# EAGLE schematic Carrier v1.0 (EAGLE 6.2)
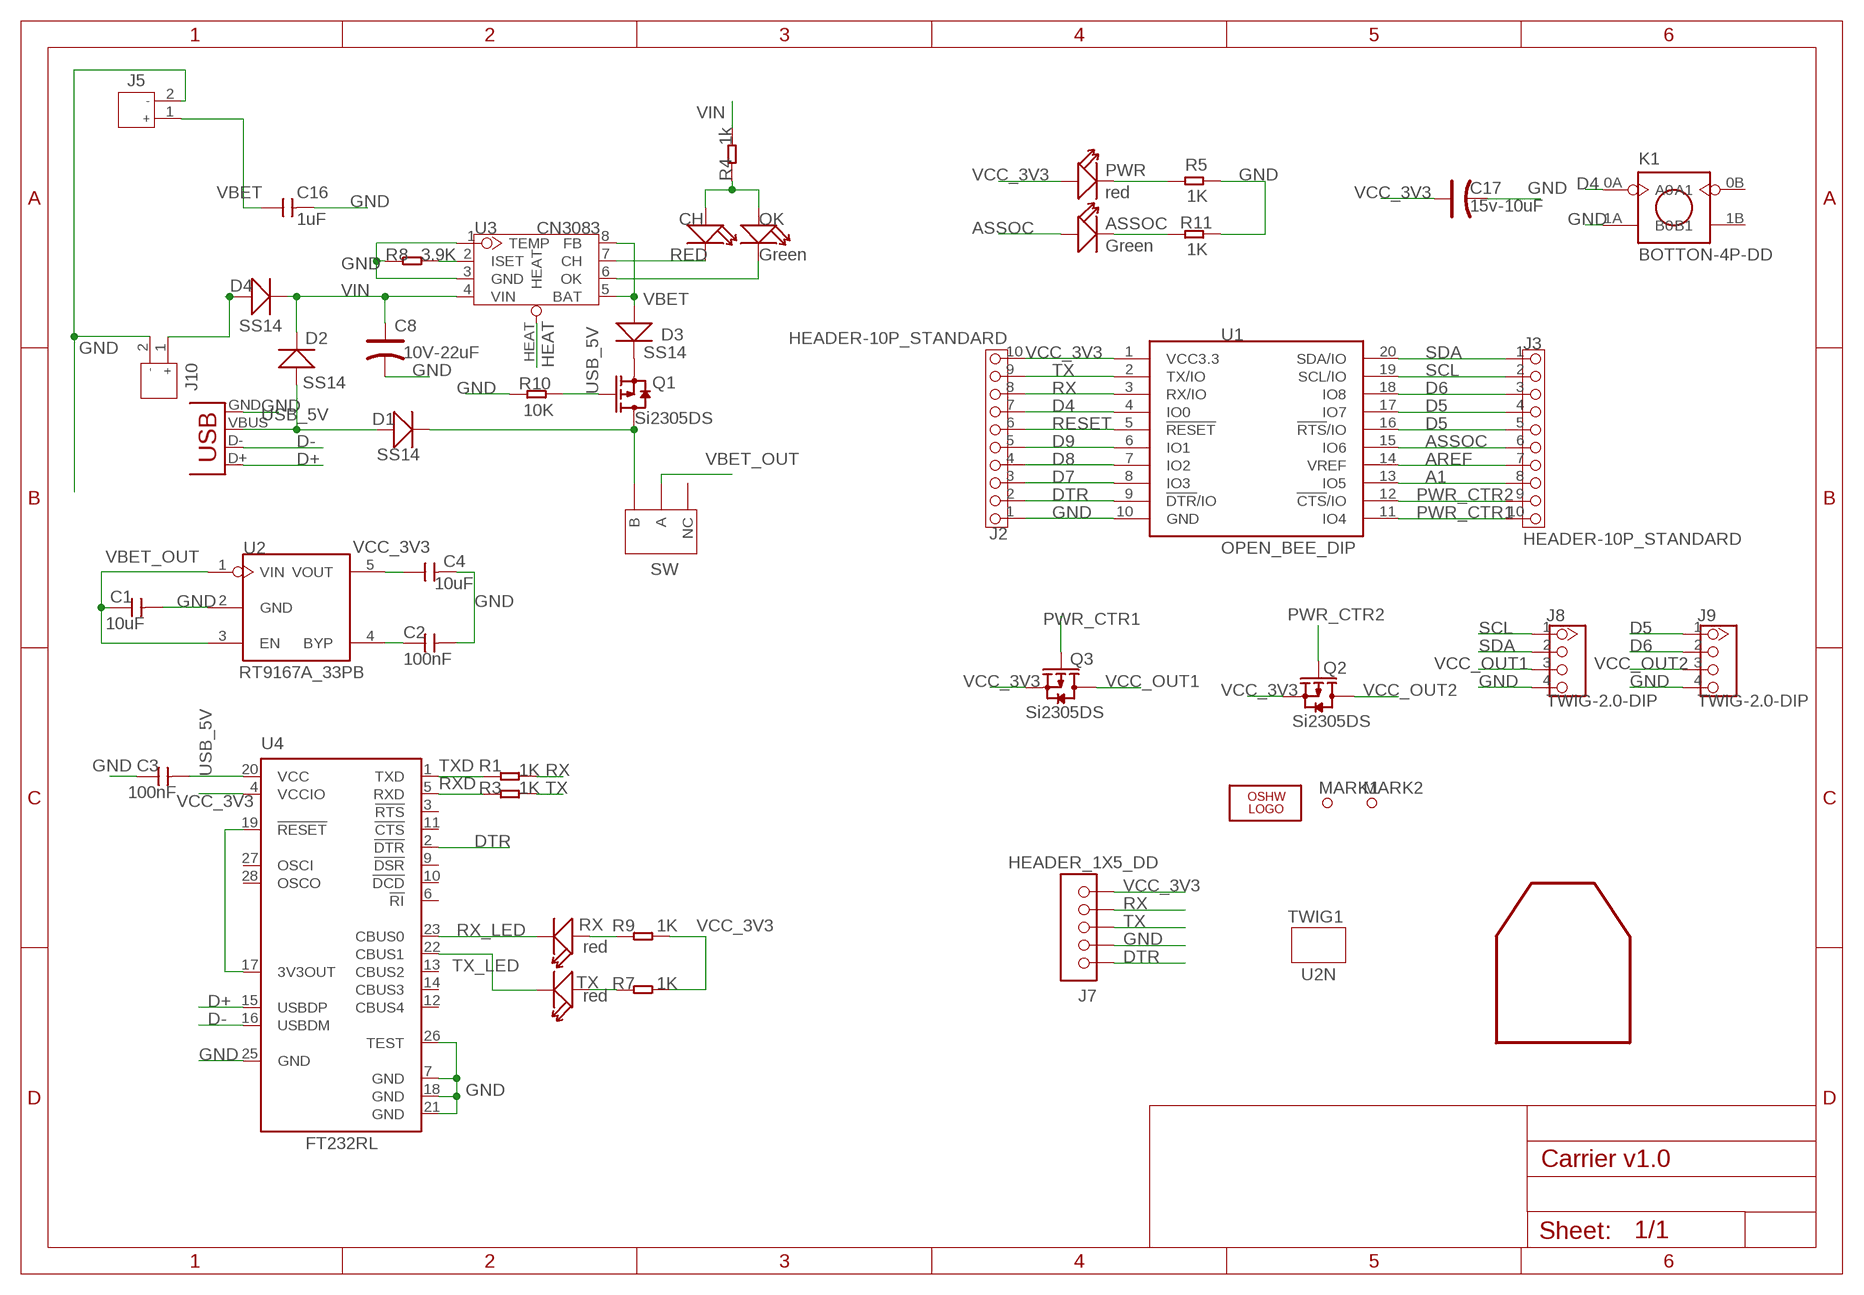
[diagram p0: schematic, sheet 1]

## Parts
ASSOC  Green  LED-0603  [D0603]
C1  10uF  C-0805  [0805]
C2  100nF  C-0603  [0603]
C3  100nF  C-0603  [0603]
C4  10uF  C-0805  [0805]
C8  10V-22uF  CAP_AVX_B  [AVX-B]
C16  1uF  C-0805  [0805]
C17  15v-10uF  CAP_AVX_A  [AVX-A]
CH  RED  LED-0603  [D0603]
D1  SS14  D-2010  [D2010]
D2  SS14  D-2010  [D2010]
D3  SS14  D-2010  [D2010]
D4  SS14  D-2010  [D2010]
J2  HEADER-10P_STANDARD  [2.54_10P]
J3  HEADER-10P_STANDARD  [2.54_10P]
J5  JST-2P-POWER-LEADED  [2P-2.0-LEADED-4.7X6.0]
J7  HEADER_1X5_DD  [CK_1X5]
J8  TWIG-2.0-DIP  [2.0_1X4]
J9  TWIG-2.0-DIP  [2.0_1X4]
J10  JST-2P-POWER-LEADED  [2P-2.0-LEADED-4.7X6.0]
K1  BOTTON-4P-DD  [BTN-S]
LOGO2  OSHW_LOGO_FILLX0200-NT  [OSHW_FILLX200_NOTEXT]
MARK1  PAD-MARK  [MARK]
MARK2  PAD-MARK  [MARK]
OK  Green  LED-0603  [D0603]
PWR  red  LED-0805  [D0805]
Q1  Si2305DS  010-P-MOSFETSOT23  [SOT23]
Q2  Si2305DS  010-P-MOSFETSOT23  [SOT23]
Q3  Si2305DS  010-P-MOSFETSOT23  [SOT23]
R1  1K  R-0603  [0603]
R3  1K  R-0603  [0603]
R4  1k  R-0603  [0603]
R5  1K  R-0603  [0603]
R7  1K  R-0603  [0603]
R8  3.9K  R-0603  [0603]
R9  1K  R-0603  [0603]
R10  10K  R-0603  [0603]
R11  1K  R-0603  [0603]
RX  red  LED-0603  [D0603]
SW  SWITCH-3P  [008-SW-3P-DIP]
TWIG1  U2N  [U2N_SILK]
TX  red  LED-0603  [D0603]
U1  OPEN_BEE_DIP  [CCBEE-PRO]
U2  RT9167A_33PB  RT9167A  [SOT23-5]
U3  CN3083  [SOP8]
U4  FT232RL  [SSOP28]
U$1  WIFI_SILK  [WIFI_SILK]
X1  USB-SMD-NS  [USB-MINIB-NOSTOP]

## Nets
A1: J3.8 U1.13(IO5)
AREF: J3.7 U1.14(VREF)
ASSOC: ASSOC.+ J3.6 U1.15(IO6)
D4: J2.7 K1.0A(A0) U1.4(IO0)
D5: J3.4 J3.5 J9.1 U1.16(!RTS!/IO) U1.17(IO7)
D6: J3.3 J9.2 U1.18(IO8)
D7: J2.3 U1.8(IO3)
D8: J2.4 U1.7(IO2)
D9: J2.5 U1.6(IO1)
D+: U4.15(USBDP) X1.D+
D-: U4.16(USBDM) X1.D-
DTR: J2.2 J7.1 U1.9(!DTR!/IO) U4.2(!DTR)
GND: C1.2 C2.2 C3.1 C4.2 C8.- C16.2 C17.- J2.1 J5.2 J7.2 J8.4 J9.4 J10.2 K1.1A(B0) R5.1 R8.1 R10.1 R11.1 U1.10(GND) U2.2(GND) U3.1(TEMP) U3.3(GND) U4.7(GND) U4.18(GND) U4.21(GND) U4.25(GND) U4.26(TEST) X1.GND
HEAT: U3.HEAT
N$1: PWR.- R5.2
N$2: R8.2 U3.2(ISET)
N$3: D4.+ J10.1
N$6: C2.1 U2.4(BYP)
N$7: CH.- U3.7(CH)
N$8: OK.- U3.6(OK)
N$9: CH.+ OK.+ R4.1
N$10: U4.17(3V3OUT) U4.19(!RESET)
N$11: D3.- Q1.2(S)
N$12: ASSOC.- R11.2
N$13: D1.- Q1.3(D) SW.P$3(B)
N$15: R9.1 RX.+
N$16: R7.1 TX.+
PWR_CTR1: J3.10 Q3.1(G) U1.11(IO4)
PWR_CTR2: J3.9 Q2.1(G) U1.12(!CTS!/IO)
RESET: J2.6 U1.5(!RESET)
RX: J2.8 J7.4 R1.2 U1.3(RX/IO)
RX_LED: RX.- U4.23(CBUS0)
RXD: R3.1 U4.5(RXD)
SCL: J3.2 J8.1 U1.19(SCL/IO)
SDA: J3.1 J8.2 U1.20(SDA/IO)
TX: J2.9 J7.3 R3.2 U1.2(TX/IO)
TX_LED: TX.- U4.22(CBUS1)
TXD: R1.1 U4.1(TXD)
USB_5V: C3.2 D1.+ D2.+ Q1.1(G) R10.2 U4.20(VCC) X1.VBUS
VBET: C16.1 D3.+ J5.1 U3.5(BAT) U3.8(FB)
VBET_OUT: C1.1 SW.P$2(A) U2.1(VIN) U2.3(EN)
VCC_3V3: C4.1 C17.+ J2.10 J7.5 PWR.+ Q2.2(S) Q3.2(S) R7.2 R9.2 U1.1(VCC3.3) U2.5(VOUT) U4.4(VCCIO)
VCC_OUT1: J8.3 Q3.3(D)
VCC_OUT2: J9.3 Q2.3(D)
VIN: C8.+ D2.- D4.- R4.2 U3.4(VIN)
Unconnected: K1.0B(A1) K1.1B(B1) SW.P$1(NC) U4.3(!RTS) U4.6(!RI) U4.9(!DSR) U4.10(!DCD) U4.11(!CTS) U4.12(CBUS4) U4.13(CBUS2) U4.14(CBUS3) U4.27(OSCI) U4.28(OSCO)

## Library data of the parts
ASSOC CH OK PWR RX TX = Discrete:LED*
C1-C4 C16 = Discrete:C*: Ceramic Capacitors
C8 C17 = Discrete:CAP*: Electrolytic Capacitors,Tantalum Capacitors and Super Capacitors
D1-D4 = Discrete:D*
J2 J3 = Connector:HEADER-10P
J5 J10 = Connector:JST-2P-POWER-LEADED
J7 = CONNECTER:HEADER_1X5
J8 J9 = Connector:TWIG-2.0-DIP
K1 = Discrete:BOTTON-4P
LOGO2 = logo:OSHW_LOGO_FILL
MARK1 MARK2 = Discrete:PAD-MARK
Q1-Q3 = Discrete:010-P-MOSFET*: Si2305DS Si2323CDS
R1 R3-R5 R7-R11 = Discrete:R*
SW = Discrete:SWITCH-3P
TWIG1 = twig_template1:U2N
U1 = EXT_moudle:OPEN_BEE
U2 = IC:RT9167A: Voltage regulator
U3 = IC:CN3083
U4 = IC:FT232R: Source: http://www.ftdichip.com/Documents/DataSheets/DS_FT232R_v104.pdf
U$1 = seeedleo:WIFI_SILK
X1 = SparkFun-Connectors:USB: USB Connectors USB-B-PTH is fully proven SKU : PRT-00139 USB-miniB is fully proven SKU : PRT-00587 USB-A-PCB is untested. USB-A-H is throughly reviewed, but untested. Spark Fun Electronics SKU : PRT-00437 USB-B-SMT is throughly reviewed, but untested. Needs silkscreen touching up. USB-A-S has not been used/tested USB-MB-H has not been used/tested

## Net classes
0 default: width 0.203 mm, drill 0.305 mm, clearance 0.127 mm